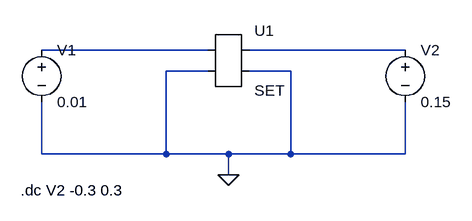
[diagram p0: schematic primerset.asc]
primerset.asc, the LTspice schematic file:
Version 4
SHEET 1 880 680
WIRE 144 96 -112 96
WIRE 448 96 208 96
WIRE 144 128 80 128
WIRE 272 128 208 128
WIRE -112 256 -112 176
WIRE 80 256 80 128
WIRE 80 256 -112 256
WIRE 176 256 80 256
WIRE 272 256 272 128
WIRE 272 256 176 256
WIRE 448 256 448 176
WIRE 448 256 272 256
WIRE 176 288 176 256
FLAG 176 288 0
SYMBOL AutoGenerated\\SET 176 112 R0
SYMATTR InstName U1
SYMBOL voltage -112 80 R0
SYMATTR InstName V1
SYMATTR Value 0.01
SYMBOL voltage 448 80 R0
SYMATTR InstName V2
SYMATTR Value 0.15
TEXT -144 312 Left 2 !.dc V2 -0.3 0.3

The netlist it stands for:
* primerset.asc
* U1: SET (symbol AutoGenerated\SET not available, pins judged from their places): pin1=N001 pin2=0 pin3=N002 pin4=0
V1 N001 0 0.01
V2 N002 0 0.15
.dc V2 -0.3 0.3
.backanno
.end